# EAGLE schematic Input (EAGLE 6.3)
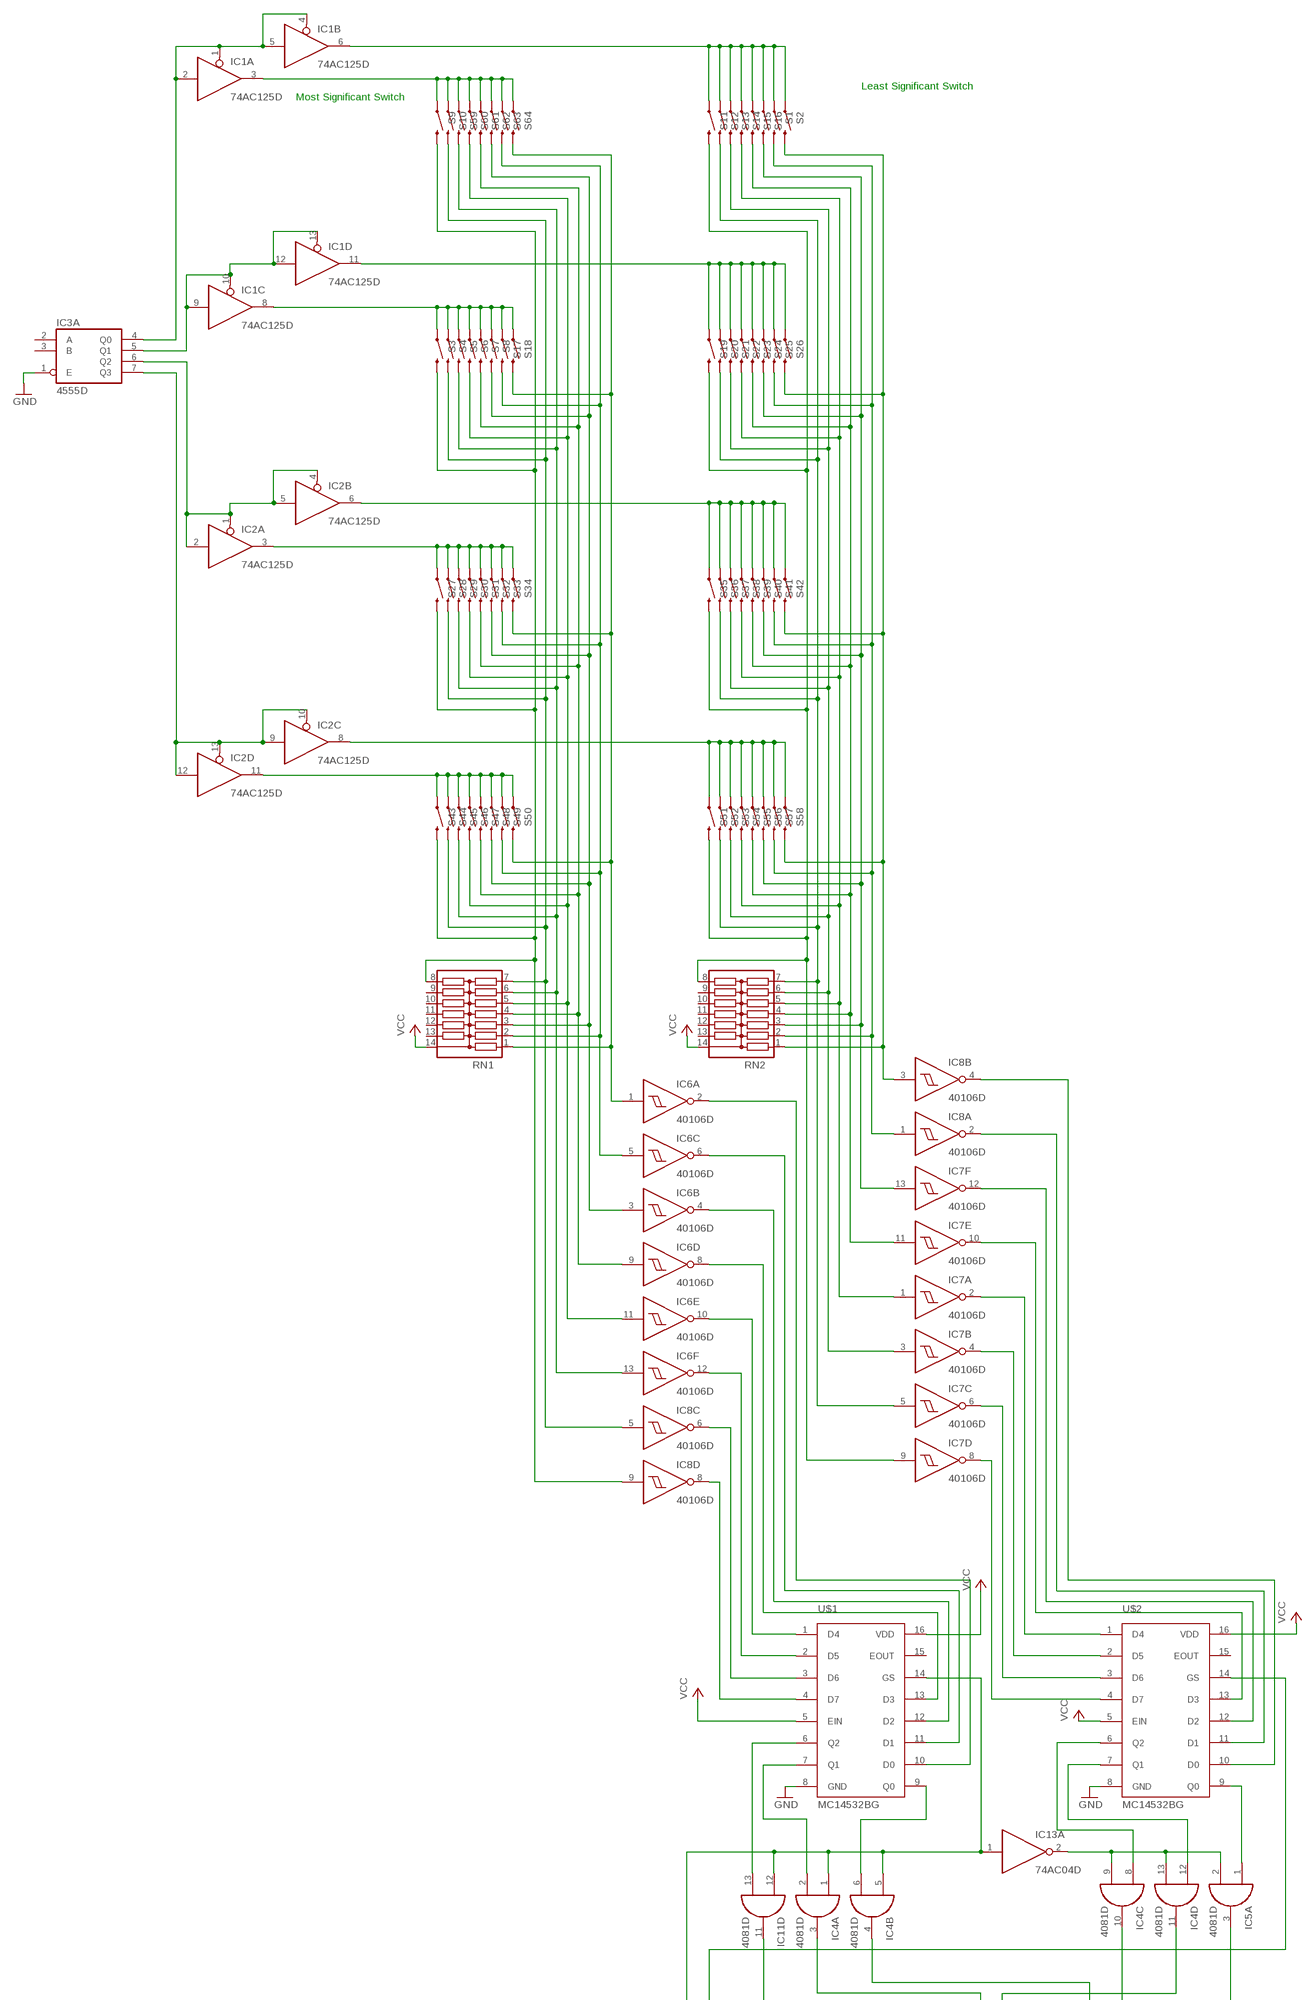
[diagram p0: schematic, sheet 1, part 1 of 2]
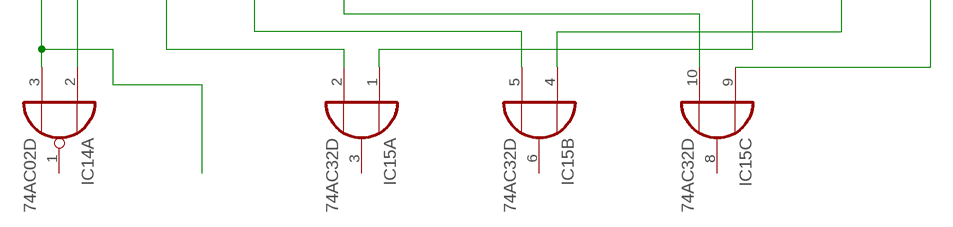
[diagram p1: schematic, sheet 1, part 2 of 2]

## Parts
IC1  74AC125D  [SO14]
IC2  74AC125D  [SO14]
IC3  4555D  [SO16]
IC4  4081D  [SO14]
IC5  4081D  [SO14]
IC6  40106D  [SO14]
IC7  40106D  [SO14]
IC8  40106D  [SO14]
IC11  4081D  [SO14]
IC13  74AC04D  [SO14]
IC14  74AC02D  [SO14]
IC15  74AC32D  [SO14]
RN1  13RSOMC  [SOMC14]
RN2  13RSOMC  [SOMC14]
S1  SWITCH-MOMENTARY-2PTH  [TACTILE-PTH]
S2  SWITCH-MOMENTARY-2PTH  [TACTILE-PTH]
S3  SWITCH-MOMENTARY-2PTH  [TACTILE-PTH]
S4  SWITCH-MOMENTARY-2PTH  [TACTILE-PTH]
S5  SWITCH-MOMENTARY-2PTH  [TACTILE-PTH]
S6  SWITCH-MOMENTARY-2PTH  [TACTILE-PTH]
S7  SWITCH-MOMENTARY-2PTH  [TACTILE-PTH]
S8  SWITCH-MOMENTARY-2PTH  [TACTILE-PTH]
S9  SWITCH-MOMENTARY-2PTH  [TACTILE-PTH]
S10  SWITCH-MOMENTARY-2PTH  [TACTILE-PTH]
S11  SWITCH-MOMENTARY-2PTH  [TACTILE-PTH]
S12  SWITCH-MOMENTARY-2PTH  [TACTILE-PTH]
S13  SWITCH-MOMENTARY-2PTH  [TACTILE-PTH]
S14  SWITCH-MOMENTARY-2PTH  [TACTILE-PTH]
S15  SWITCH-MOMENTARY-2PTH  [TACTILE-PTH]
S16  SWITCH-MOMENTARY-2PTH  [TACTILE-PTH]
S17  SWITCH-MOMENTARY-2PTH  [TACTILE-PTH]
S18  SWITCH-MOMENTARY-2PTH  [TACTILE-PTH]
S19  SWITCH-MOMENTARY-2PTH  [TACTILE-PTH]
S20  SWITCH-MOMENTARY-2PTH  [TACTILE-PTH]
S21  SWITCH-MOMENTARY-2PTH  [TACTILE-PTH]
S22  SWITCH-MOMENTARY-2PTH  [TACTILE-PTH]
S23  SWITCH-MOMENTARY-2PTH  [TACTILE-PTH]
S24  SWITCH-MOMENTARY-2PTH  [TACTILE-PTH]
S25  SWITCH-MOMENTARY-2PTH  [TACTILE-PTH]
S26  SWITCH-MOMENTARY-2PTH  [TACTILE-PTH]
S27  SWITCH-MOMENTARY-2PTH  [TACTILE-PTH]
S28  SWITCH-MOMENTARY-2PTH  [TACTILE-PTH]
S29  SWITCH-MOMENTARY-2PTH  [TACTILE-PTH]
S30  SWITCH-MOMENTARY-2PTH  [TACTILE-PTH]
S31  SWITCH-MOMENTARY-2PTH  [TACTILE-PTH]
S32  SWITCH-MOMENTARY-2PTH  [TACTILE-PTH]
S33  SWITCH-MOMENTARY-2PTH  [TACTILE-PTH]
S34  SWITCH-MOMENTARY-2PTH  [TACTILE-PTH]
S35  SWITCH-MOMENTARY-2PTH  [TACTILE-PTH]
S36  SWITCH-MOMENTARY-2PTH  [TACTILE-PTH]
S37  SWITCH-MOMENTARY-2PTH  [TACTILE-PTH]
S38  SWITCH-MOMENTARY-2PTH  [TACTILE-PTH]
S39  SWITCH-MOMENTARY-2PTH  [TACTILE-PTH]
S40  SWITCH-MOMENTARY-2PTH  [TACTILE-PTH]
S41  SWITCH-MOMENTARY-2PTH  [TACTILE-PTH]
S42  SWITCH-MOMENTARY-2PTH  [TACTILE-PTH]
S43  SWITCH-MOMENTARY-2PTH  [TACTILE-PTH]
S44  SWITCH-MOMENTARY-2PTH  [TACTILE-PTH]
S45  SWITCH-MOMENTARY-2PTH  [TACTILE-PTH]
S46  SWITCH-MOMENTARY-2PTH  [TACTILE-PTH]
S47  SWITCH-MOMENTARY-2PTH  [TACTILE-PTH]
S48  SWITCH-MOMENTARY-2PTH  [TACTILE-PTH]
S49  SWITCH-MOMENTARY-2PTH  [TACTILE-PTH]
S50  SWITCH-MOMENTARY-2PTH  [TACTILE-PTH]
S51  SWITCH-MOMENTARY-2PTH  [TACTILE-PTH]
S52  SWITCH-MOMENTARY-2PTH  [TACTILE-PTH]
S53  SWITCH-MOMENTARY-2PTH  [TACTILE-PTH]
S54  SWITCH-MOMENTARY-2PTH  [TACTILE-PTH]
S55  SWITCH-MOMENTARY-2PTH  [TACTILE-PTH]
S56  SWITCH-MOMENTARY-2PTH  [TACTILE-PTH]
S57  SWITCH-MOMENTARY-2PTH  [TACTILE-PTH]
S58  SWITCH-MOMENTARY-2PTH  [TACTILE-PTH]
S59  SWITCH-MOMENTARY-2PTH  [TACTILE-PTH]
S60  SWITCH-MOMENTARY-2PTH  [TACTILE-PTH]
S61  SWITCH-MOMENTARY-2PTH  [TACTILE-PTH]
S62  SWITCH-MOMENTARY-2PTH  [TACTILE-PTH]
S63  SWITCH-MOMENTARY-2PTH  [TACTILE-PTH]
S64  SWITCH-MOMENTARY-2PTH  [TACTILE-PTH]
U$1  MC14532BG  [SOIC-16]
U$2  MC14532BG  [SOIC-16]

## Nets
GND: IC3.1(A:E) U$1.8(GND) U$2.8(GND)
N$1: IC1.1(A:OE) IC1.2(A:I) IC1.4(B:OE) IC1.5(B:I) IC3.4(A:Q0)
N$2: IC1.9(C:I) IC1.10(C:OE) IC1.12(D:I) IC1.13(D:OE) IC3.5(A:Q1)
N$3: IC2.1(A:OE) IC2.2(A:I) IC2.4(B:OE) IC2.5(B:I) IC3.6(A:Q2)
N$4: IC2.9(C:I) IC2.10(C:OE) IC2.12(D:I) IC2.13(D:OE) IC3.7(A:Q3)
N$5: IC1.3(A:O) S9.1 S10.1 S59.1 S60.1 S61.1 S62.1 S63.1 S64.1
N$6: IC1.8(C:O) S3.1 S4.1 S5.1 S6.1 S7.1 S8.1 S17.1 S18.1
N$7: IC8.8(D:O) U$1.4(D7)
N$8: IC6.6(C:O) U$1.11(D1)
N$9: IC2.6(B:O) S35.1 S36.1 S37.1 S38.1 S39.1 S40.1 S41.1 S42.1
N$10: IC8.3(B:I) RN2.1 S2.3 S26.3 S42.3 S58.3
N$11: IC8.1(A:I) RN2.2 S1.3 S25.3 S41.3 S57.3
N$12: IC7.13(F:I) RN2.3 S16.3 S24.3 S40.3 S56.3
N$13: IC7.11(E:I) RN2.4 S15.3 S23.3 S39.3 S55.3
N$14: IC7.3(B:I) RN2.6 S13.3 S21.3 S37.3 S53.3
N$15: IC7.5(C:I) RN2.7 S12.3 S20.3 S36.3 S52.3
N$16: IC7.9(D:I) RN2.8 S11.3 S19.3 S35.3 S51.3
N$17: IC2.8(C:O) S51.1 S52.1 S53.1 S54.1 S55.1 S56.1 S57.1 S58.1
N$18: IC7.1(A:I) RN2.5 S14.3 S22.3 S38.3 S54.3
N$19: IC8.4(B:O) U$2.10(D0)
N$20: U$1.12(D2)
N$21: IC6.8(D:O) U$1.13(D3)
N$23: IC2.3(A:O) S27.1 S28.1 S29.1 S30.1 S31.1 S32.1 S33.1 S34.1
N$24: IC6.1(A:I) RN1.1 S18.3 S34.3 S50.3 S64.3
N$25: IC6.5(C:I) RN1.2 S17.3 S33.3 S49.3 S63.3
N$26: IC6.3(B:I) RN1.3 S8.3 S32.3 S48.3 S62.3
N$27: IC6.9(D:I) RN1.4 S7.3 S31.3 S47.3 S61.3
N$28: IC6.12(F:O) U$1.2(D5)
N$29: IC6.13(F:I) RN1.6 S5.3 S29.3 S45.3 S59.3
N$30: IC8.5(C:I) RN1.7 S4.3 S10.3 S28.3 S44.3
N$31: IC8.9(D:I) RN1.8 S3.3 S9.3 S27.3 S43.3
N$32: IC7.8(D:O) U$2.4(D7)
N$33: IC2.11(D:O) S43.1 S44.1 S45.1 S46.1 S47.1 S48.1 S49.1 S50.1
N$34: IC1.6(B:O) S1.1 S2.1 S11.1 S12.1 S13.1 S14.1 S15.1 S16.1
N$35: IC1.11(D:O) S19.1 S20.1 S21.1 S22.1 S23.1 S24.1 S25.1 S26.1
N$36: IC8.6(C:O) U$1.3(D6)
N$37: IC4.1(A:I0) IC4.5(B:I0) IC11.12(D:I0) IC13.1(A:I) IC14.3(A:I1) U$1.14(GS)
N$38: IC6.11(E:I) RN1.5 S6.3 S30.3 S46.3 S60.3
N$39: IC8.2(A:O) U$2.11(D1)
N$40: IC7.12(F:O) U$2.12(D2)
N$41: IC7.10(E:O) U$2.13(D3)
N$42: IC7.2(A:O) U$2.1(D4)
N$43: IC7.4(B:O) U$2.2(D5)
N$44: IC7.6(C:O) U$2.3(D6)
N$45: IC4.9(C:I1) IC4.13(D:I1) IC5.2(A:I1) IC13.2(A:O)
N$48: IC4.6(B:I1) U$1.9(Q0)
N$54: IC11.13(D:I1) U$1.6(Q2)
N$61: IC6.10(E:O) U$1.1(D4)
N$62: IC6.4(B:O)
N$63: IC4.2(A:I1) U$1.7(Q1)
N$64: IC6.2(A:O) U$1.10(D0)
N$65: IC4.8(C:I0) U$2.6(Q2)
N$66: IC4.12(D:I0) U$2.7(Q1)
N$67: IC5.1(A:I0) U$2.9(Q0)
N$68: IC14.2(A:I0) U$2.14(GS)
N$69: IC11.11(D:O) IC15.2(A:I1)
N$70: IC4.10(C:O) IC15.1(A:I0)
N$71: IC4.3(A:O) IC15.5(B:I1)
N$72: IC4.4(B:O) IC15.10(C:I1)
N$73: IC4.11(D:O) IC15.4(B:I0)
N$74: IC5.3(A:O) IC15.9(C:I0)
VCC: RN1.14 RN2.14 U$1.5(EIN) U$1.16(VDD) U$2.5(EIN) U$2.16(VDD)
Unconnected: IC3.2(A:A) IC3.3(A:B) IC3.9(B:Q3) IC3.10(B:Q2) IC3.11(B:Q1) IC3.12(B:Q0) IC3.13(B:B) IC3.14(B:A) IC3.15(B:E) IC5.4(B:O) IC5.5(B:I0) IC5.6(B:I1) IC5.8(C:I0) IC5.9(C:I1) IC5.10(C:O) IC5.11(D:O) IC5.12(D:I0) IC5.13(D:I1) IC8.10(E:O) IC8.11(E:I) IC8.12(F:O) IC8.13(F:I) IC11.1(A:I0) IC11.2(A:I1) IC11.3(A:O) IC11.4(B:O) IC11.5(B:I0) IC11.6(B:I1) IC11.8(C:I0) IC11.9(C:I1) IC11.10(C:O) IC13.3(B:I) IC13.4(B:O) IC13.5(C:I) IC13.6(C:O) IC13.8(D:O) IC13.9(D:I) IC13.10(E:O) IC13.11(E:I) IC13.12(F:O) IC13.13(F:I) IC14.1(A:O) IC14.4(B:O) IC14.5(B:I0) IC14.6(B:I1) IC14.8(C:I0) IC14.9(C:I1) IC14.10(C:O) IC14.11(D:I0) IC14.12(D:I1) IC14.13(D:O) IC15.3(A:O) IC15.6(B:O) IC15.8(C:O) IC15.11(D:O) IC15.12(D:I0) IC15.13(D:I1) RN1.9 RN1.10 RN1.11 RN1.12 RN1.13 RN2.9 RN2.10 RN2.11 RN2.12 RN2.13 U$1.15(EOUT) U$2.15(EOUT)

## Notes on the sheet
- Least Significant Switch
- Most Significant Switch

## Power pins joined to a net without a drawn wire
GND: IC1.7(P:GND) IC2.7(P:GND) IC13.7(P:GND) IC14.7(P:GND) IC15.7(P:GND)
VCC: IC1.14(P:VCC) IC2.14(P:VCC) IC13.14(P:VCC) IC14.14(P:VCC) IC15.14(P:VCC)
VDD: IC3.16(P:VDD) IC4.14(P:VDD) IC5.14(P:VDD) IC6.14(P:VDD) IC7.14(P:VDD) IC8.14(P:VDD) IC11.14(P:VDD)
VSS: IC3.8(P:VSS) IC4.7(P:VSS) IC5.7(P:VSS) IC6.7(P:VSS) IC7.7(P:VSS) IC8.7(P:VSS) IC11.7(P:VSS)

## Library data of the parts
IC1 IC2 = 74xx-eu:74*125: Quad bus BUFFER, 3-state
IC3 = 45xx:4555: Dual binary 1 of 4 DECODER/DEMULTIPLEXER
IC4 IC5 IC11 = 40xx:4081: Quad 2-input AND
IC6-IC8 = 40xx:40106: Hex SCHMITT TRIGGER
IC13 = 74xx-eu:74*04: Hex INVERTER
IC14 = 74xx-eu:74*02: Quad 2-input NOR gate
IC15 = 74xx-eu:74*32: Quad 2-input OR gate
RN1 RN2 = resistor-dil:13R: DIL RESISTOR; MPN: SOMC140313R0GEJ; OC_FARNELL: unknown; OC_NEWARK: 48P4478
S1-S64 = SparkFun:SWITCH-MOMENTARY-2
U$1 U$2 = MC14532BG:MC14532BG: ON SEMICONDUCTOR 8 to 3 ENCODER